# Altium schematic sheet [1] Block Diagram.SchDoc: Block Diagram - SmartPower
size A3; Author: Caner ALP; Organization: ALP Electronics; Address1: Axel Oxenstiernas; Address2: Västerås; Address3: 72478; Address4: Sweden; DocumentNumber: 1; Revision: P0.1; SheetNumber: 1; SheetTotal: 7
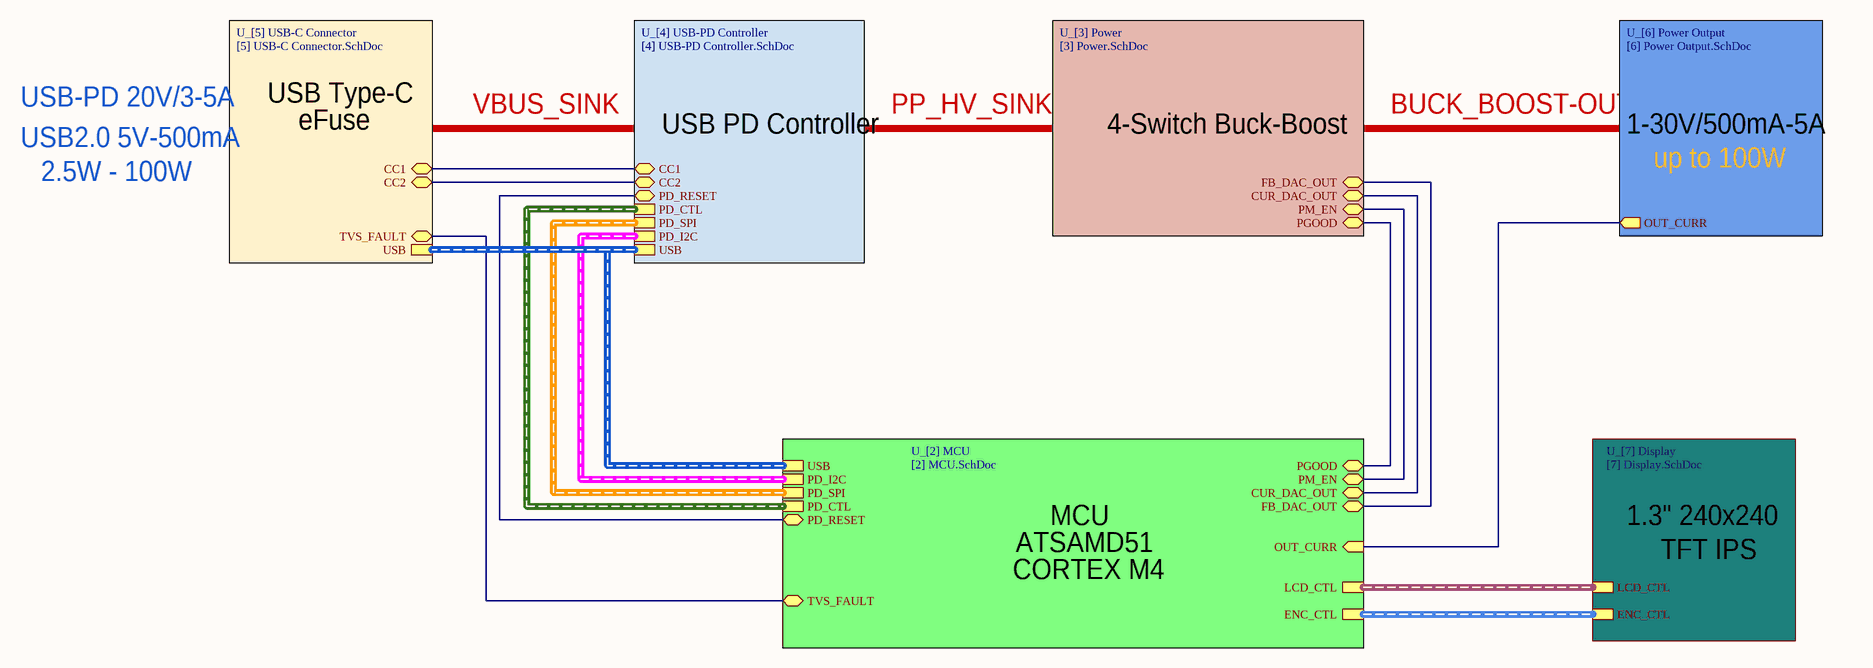
[diagram p0: [1] Block Diagram.SchDoc]

## Sub-sheets
U_[2] MCU = [2] MCU.SchDoc: PM_EN (bidir), CUR_DAC_OUT (bidir), PD_I2C (harness PD_I2C_H), USB (harness USB_H), PGOOD (bidir), PD_RESET (bidir), PD_CTL (harness PD_H), TVS_FAULT (bidir), FB_DAC_OUT (bidir), PD_SPI (harness PD_SPI_H), ENC_CTL (harness ENCODER), LCD_CTL (harness LCD), OUT_CURR (in)
U_[3] Power = [3] Power.SchDoc: FB_DAC_OUT (bidir), CUR_DAC_OUT (bidir), PM_EN (bidir), PGOOD (bidir)
U_[4] USB-PD Controller = [4] USB-PD Controller.SchDoc: PD_RESET (bidir), PD_CTL (harness PD_H), PD_SPI (harness PD_SPI_H), USB (harness USB_H), PD_I2C (harness PD_I2C_H), CC2 (bidir), CC1 (bidir)
U_[5] USB-C Connector = [5] USB-C Connector.SchDoc: USB (harness USB_H), TVS_FAULT (bidir), CC1 (bidir), CC2 (bidir)
U_[6] Power Output = [6] Power Output.SchDoc: OUT_CURR (out)
U_[7] Display = [7] Display.SchDoc: LCD_CTL (harness LCD), ENC_CTL (harness ENCODER)

## Nets
(unnamed): sheet U_[2] MCU/PM_EN, sheet U_[3] Power/PM_EN
(unnamed): sheet U_[2] MCU/CUR_DAC_OUT, sheet U_[3] Power/CUR_DAC_OUT
(unnamed): sheet U_[2] MCU/PGOOD, sheet U_[3] Power/PGOOD
(unnamed): sheet U_[2] MCU/PD_RESET, sheet U_[4] USB-PD Controller/PD_RESET
(unnamed): sheet U_[2] MCU/TVS_FAULT, sheet U_[5] USB-C Connector/TVS_FAULT
(unnamed): sheet U_[2] MCU/FB_DAC_OUT, sheet U_[3] Power/FB_DAC_OUT
(unnamed): sheet U_[2] MCU/OUT_CURR, sheet U_[6] Power Output/OUT_CURR
(unnamed): sheet U_[5] USB-C Connector/CC1, sheet U_[4] USB-PD Controller/CC1
(unnamed): sheet U_[5] USB-C Connector/CC2, sheet U_[4] USB-PD Controller/CC2

## Buses and harness runs
harness sheet U_[2] MCU/ENC_CTL = sheet U_[7] Display/ENC_CTL
harness sheet U_[2] MCU/LCD_CTL = sheet U_[7] Display/LCD_CTL
harness sheet U_[2] MCU/PD_CTL = sheet U_[4] USB-PD Controller/PD_CTL
harness sheet U_[2] MCU/PD_I2C = sheet U_[4] USB-PD Controller/PD_I2C
harness sheet U_[2] MCU/PD_SPI = sheet U_[4] USB-PD Controller/PD_SPI
harness sheet U_[2] MCU/USB = sheet U_[4] USB-PD Controller/USB = sheet U_[5] USB-C Connector/USB

## Notes on the sheet
- USB-PD 20V/3-5A
- USB Type-C
- VBUS_SINK
- PP_HV_SINK
- BUCK_BOOST-OUT
- USB2.0 5V-500mA
- 2.5W - 100W
- eFuse
- USB PD Controller
- 4-Switch Buck-Boost
- 1-30V/500mA-5A
- up to 100W
- MCU
- 1.3" 240x240
- CORTEX M4
- ATSAMD51
- TFT IPS
- Title
- Size:
- Project
- A3
- Revision:
- Date:
- Sheet
- of